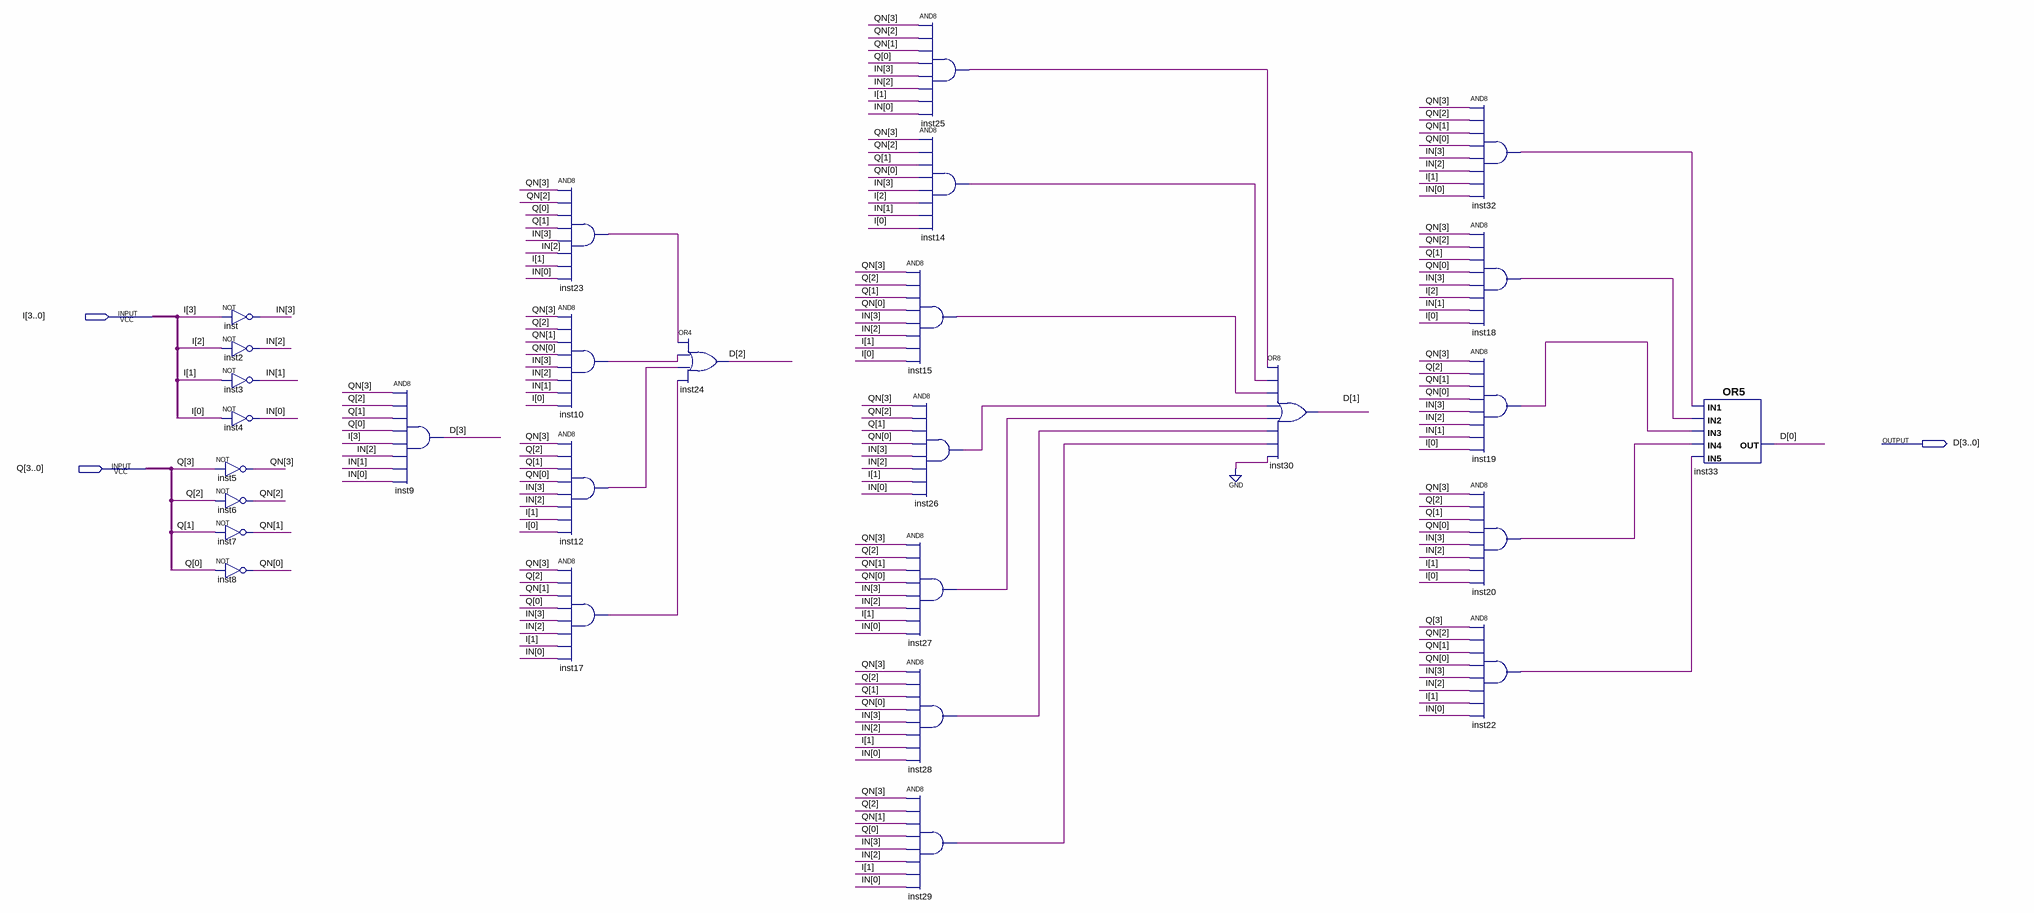
[diagram p0: schematic sheet]
// Quartus schematic NEXT_STATE.bdf as structural Verilog: 28 symbols, 3 pins
module NEXT_STATE (
  input  [3:0] I,
  input  [3:0] Q,
  output [3:0] D
);

  wire inst10_out, inst12_out, inst14_out, inst15_out, inst17_out, inst18_out, inst19_out, inst20_out,
       inst22_out, inst23_out, inst25_out, inst26_out, inst27_out, inst28_out, inst29_out, inst32_out;
  wire [3:0] IN, QN;

  not inst (IN[3], I[3]);
  not inst2 (IN[2], I[2]);
  not inst3 (IN[1], I[1]);
  not inst4 (IN[0], I[0]);
  not inst5 (QN[3], Q[3]);
  not inst6 (QN[2], Q[2]);
  not inst7 (QN[1], Q[1]);
  not inst8 (QN[0], Q[0]);
  and inst9 (D[3], QN[3], Q[2], Q[1], Q[0], I[3], IN[2], IN[1], IN[0]);
  and inst23 (inst23_out, QN[3], QN[2], Q[0], Q[1], IN[3], IN[2], I[1], IN[0]);
  and inst10 (inst10_out, QN[3], Q[2], QN[1], QN[0], IN[3], IN[2], IN[1], I[0]);
  and inst12 (inst12_out, QN[3], Q[2], Q[1], QN[0], IN[3], IN[2], I[1], I[0]);
  and inst17 (inst17_out, QN[3], Q[2], QN[1], Q[0], IN[3], IN[2], I[1], IN[0]);
  or inst24 (D[2], inst23_out, inst10_out, inst12_out, inst17_out);
  and inst25 (inst25_out, QN[3], QN[2], QN[1], Q[0], IN[3], IN[2], I[1], IN[0]);
  and inst14 (inst14_out, QN[3], QN[2], Q[1], QN[0], IN[3], I[2], IN[1], I[0]);
  and inst15 (inst15_out, QN[3], Q[2], Q[1], QN[0], IN[3], IN[2], I[1], I[0]);
  and inst26 (inst26_out, QN[3], QN[2], Q[1], QN[0], IN[3], IN[2], I[1], IN[0]);
  and inst27 (inst27_out, QN[3], Q[2], QN[1], QN[0], IN[3], IN[2], I[1], IN[0]);
  and inst28 (inst28_out, QN[3], Q[2], Q[1], QN[0], IN[3], IN[2], I[1], IN[0]);
  and inst29 (inst29_out, QN[3], Q[2], QN[1], Q[0], IN[3], IN[2], I[1], IN[0]);
  or inst30 (D[1], inst25_out, inst14_out, inst15_out, inst26_out, inst27_out, inst28_out, inst29_out, 1'b0);
  and inst32 (inst32_out, QN[3], QN[2], QN[1], QN[0], IN[3], IN[2], I[1], IN[0]);
  and inst18 (inst18_out, QN[3], QN[2], Q[1], QN[0], IN[3], I[2], IN[1], I[0]);
  and inst19 (inst19_out, QN[3], Q[2], QN[1], QN[0], IN[3], IN[2], IN[1], I[0]);
  and inst20 (inst20_out, QN[3], Q[2], Q[1], QN[0], IN[3], IN[2], I[1], I[0]);
  and inst22 (inst22_out, Q[3], QN[2], QN[1], QN[0], IN[3], IN[2], I[1], IN[0]);
  or inst33 (D[0], inst32_out, inst18_out, inst19_out, inst20_out, inst22_out);
endmodule
